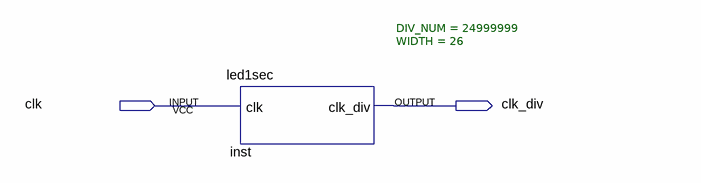
[diagram p0: schematic sheet]
// Quartus schematic Block3.bdf as structural Verilog: 1 symbols, 2 pins
module Block3 (
  input  clk,
  output clk_div
);

  led1sec #(.DIV_NUM(24999999), .WIDTH(26)) inst (.clk(clk), .clk_div(clk_div));
endmodule
